# Altium schematic sheet 01 - MCU.SchDoc
size A3; SheetNumber: 1; SheetTotal: 5; Data: 20/01/2025; Revisão: RV01B; Papel: A3; Nome da Sheet: 01 - MCU
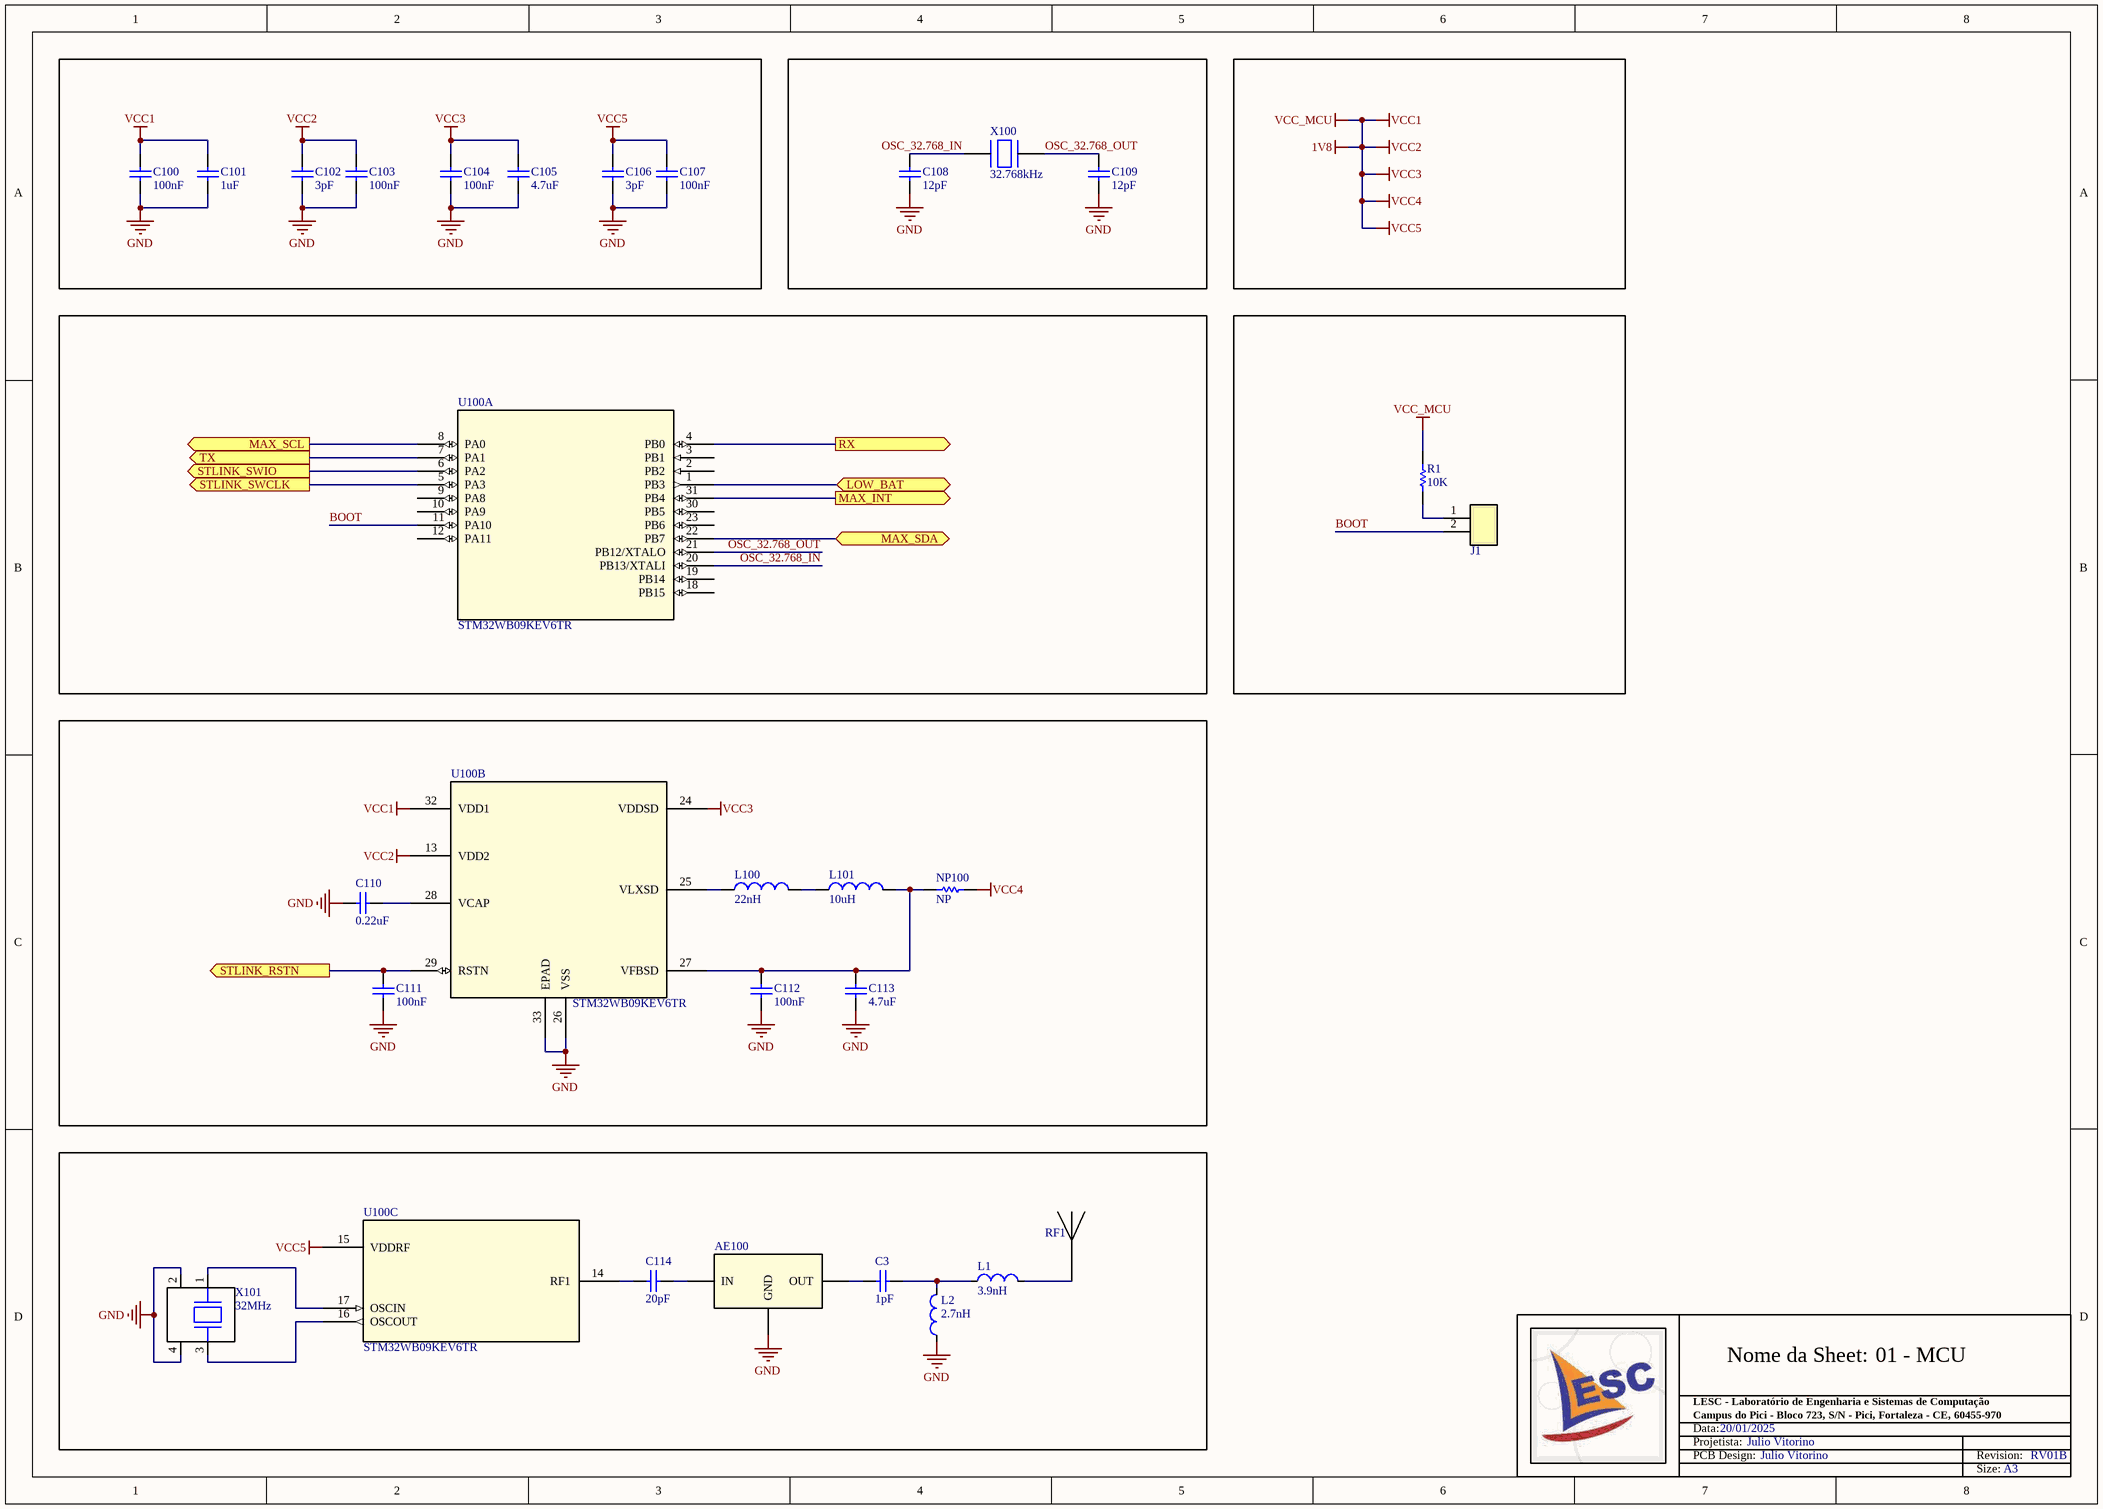
[diagram p0: 01 - MCU.SchDoc]

## Parts
AE100  RF FILTER LOW PASS 2.45GHZ 6SMD  [MLPF-WB55-01E3_STM]  (value not drawn)
C3  value 1pF  [0402-C-R-RF]  (hidden comment: GJM1555C1HR90WB01D)
C100  value 100nF  [0402-C-R]  (hidden comment: C0402C104K8RACTU)
C101  value 1uF  [0402-C-R]  (hidden comment: GRM155R61E105KA12D)
C102  value 3pF  [0402-C-R]  (hidden comment: C0402C104K8RACTU)
C103  value 100nF  [0402-C-R]  (hidden comment: C0402C104K8RACTU)
C104  value 100nF  [0402-C-R]  (hidden comment: C0402C104K8RACTU)
C105  value 4.7uF  [0402-C-R]  (hidden comment: GRM155R61A475MEAAD)
C106  value 3pF  [0402-C-R]  (hidden comment: C0402C104K8RACTU)
C107  value 100nF  [0402-C-R]  (hidden comment: C0402C104K8RACTU)
C108  value 12pF  [0402-C-R]  (hidden comment: GCM1555C1H120FA16J)
C109  value 12pF  [0402-C-R]  (hidden comment: GCM1555C1H120FA16J)
C110  value 0.22uF  [0402-C-R]  (hidden comment: C0402C104K8RACTU)
C111  value 100nF  [0402-C-R]  (hidden comment: C0402C104K8RACTU)
C112  value 100nF  [0402-C-R]  (hidden comment: C0402C104K8RACTU)
C113  value 4.7uF  [0402-C-R]  (hidden comment: GRM155R61A475MEAAD)
C114  value 20pF  [0201-C-R-RF]  (hidden comment: C0402C104K8RACTU)
J1  CONN HEADER SMD 2POS 1.27MM  [HARWIN_M50-3630242]  (value not drawn)
L1  value 3.9nH  [0402-R-L -RF]  (hidden comment: IND 3.9NH 300MA 170MOHM SM_1)
L2  value 2.7nH  [0402-R-L -RF]  (hidden comment: IND 2.7NH 300MA 170MOHM SM)
L100  IND: 22nH  [0402-R-L]  (hidden comment: IND 22NH 350MA 0.58OHM SMD)
L101  IND: 10uH  [0805-R-L]  (hidden comment: IND 10UH 300MA 680MOHM SMD)
NP100  NP  [0402-R-NP]
R1  value 10K  [0402-R-R]  (hidden comment: RMCF0402FT10K0)
RF1  RF ANT 2.4GHZ CHIP SOLDER SMD  [XCVR_2450AT18A0100001E]  (value not drawn)
U100  PN: STM32WB09KEV6TR  [VFQFPN-32_5x5x1mm_STM]  (hidden comment: IC ULTRA-LOW-POWER, ARM CORTEX-M0+)  (parts A,B,C of 3)
X100  value 32.768kHz  [XTAL_ECS-.327-12.5-34RR-TR]  (hidden comment: ECX-.327-CDX-1293)
X101  FRQ: 32MHz  [XTAL_ECS-320-8-37-CKM-TR3]  (hidden comment: ECS-320-8-37-CKM-TR3)

## Ports
LOW_BAT (bidir), MAX_INT (out), MAX_SCL (out), MAX_SDA (bidir), RX (out), STLINK_RSTN (out), STLINK_SWCLK (out), STLINK_SWIO (out), TX (out)

## Nets
1V8: C100.2 C101.2 C102.2 C103.2 C104.2 C105.2 C106.2 C107.2 NP100.2 R1.2 U100.13(VDD2) U100.15(VDDRF) U100.24(VDDSD) U100.32(VDD1)  [also labelled VCC1, VCC2, VCC3, VCC4, VCC5, VCC_MCU]
GND: AE100.2,4,5,6(GND) C100.1 C101.1 C102.1 C103.1 C104.1 C105.1 C106.1 C107.1 C108.1 C109.1 C110.1 C111.1 C112.1 C113.1 L2.1 U100.26(VSS) U100.33(EPAD) X101.2(GND) X101.4(GND)
BOOT: J1.2 U100.11(PA10)
LOW_BAT: U100.1(PB3) ; port LOW_BAT
MAX_INT: U100.31(PB4) ; port MAX_INT
MAX_SCL: U100.8(PA0) ; port MAX_SCL
MAX_SDA: U100.22(PB7) ; port MAX_SDA
OSC_32.768_IN: C108.2 U100.20(PB13/XTALI) X100.1(P$1)
OSC_32.768_OUT: C109.2 U100.21(PB12/XTALO) X100.2(P$2)
RX: U100.4(PB0) ; port RX
STLINK_RSTN: C111.2 U100.29(RSTN) ; port STLINK_RSTN
STLINK_SWCLK: U100.5(PA3) ; port STLINK_SWCLK
STLINK_SWIO: U100.6(PA2) ; port STLINK_SWIO
TX: U100.7(PA1) ; port TX
NetAE100_1: AE100.1(OUT) C3.1
NetAE100_3: AE100.3(IN) C114.2
NetC3_2: C3.2 L1.1 L2.2
NetC110_2: C110.2 U100.28(VCAP)
NetC112_2: C112.2 C113.2 L101.1 NP100.1 U100.27(VFBSD)
NetC114_1: C114.1 U100.14(RF1)
NetJ1_1: J1.1 R1.1
NetL1_2: L1.2 RF1.1
NetL100_1: L100.1 L101.2
NetL100_2: L100.2 U100.25(VLXSD)
NetU100_16: U100.16(OSCOUT) X101.3
NetU100_17: U100.17(OSCIN) X101.1

Not connected (* = marked no-connect by the designer): U100 2(PB2) 3(PB1) 9(PA8) 10(PA9) 12(PA11) 18(PB15) 19(PB14) 23(PB6) 30(PB5)

## Notes on the sheet
- Nome da Sheet:
- Data:
- Projetista:
- PCB Design:
- LESC - Laboratório de Engenharia e Sistemas de Computação
- Campus do Pici - Bloco 723, S/N - Pici, Fortaleza - CE, 60455-970
- Julio Vitorino
- Revision:
- Size:

## Library data of the parts
AE100 = RF FILTER LOW PASS 2.45GHZ 6SMD: 2.45GHz Center Frequency Low Pass RF Filter (Radio Frequency) 100MHz Bandwidth 1.1dB 6-SMD, No Lead PN: MLPF-WB55-01E3; Mfr_Name: STMicroelectronics; RefDes: RefDes; Type: Type; PN: MLPF-WB55-01E3
C3 = CAP SMD 1PF 50V C0G/NP0 0402: CAP CER 1PF 50V C0G/NP0 0402 PN: QSCF500Q1R0B1GV001T; TOLERANCE: 20%; SIZE: 0402; VOLTAGE: 50V; PN: QSCF500Q1R0B1GV001T
C100 C103 C104 C107 C111 C112 = CAP SMD 0402 100nF 10V ±20%: CAP SMD 0402 MLCC GERAL 100nF 10V ±20% 0402 X7R PN:C0402C104K8RACTU KEMET; SIZE: 0402; VOLTAGE: 10V; TOLERANCE: 20%; PN: C0402C104K8RACTU
C101 = CAP SMD 0402 1uF 25V ±10%: CAP SMD 0402 MLCC GERAL 1uF 25V ±10% 0402 X5R PN:GRM155R61E105KA12D MURATA; SIZE: 0402; VOLTAGE: 25V; TOLERANCE: 10%; PN: GRM155R61E105KA12D
C102 C106 = CAP SMD 0402 3pF 50V ±0.1pF: CAP CER 3PF 50V C0G/NP0 0402 PN: 0402N3R0B500CT; TOLERANCE: ±0.1pF; SIZE: 0402; VOLTAGE: 50V; PN: 0402N3R0B500CT
C105 C113 = CAP SMD 0402 4.7uF 10V ±20%: CAP SMD 0402 MLCC GERAL 4.7uF 10V ±20% 0402 X5R PN:GRM155R61A475MEAAD MURATA; SIZE: 0402; VOLTAGE: 10V; TOLERANCE: 20%; PN: GRM155R61A475MEAAD
C108 C109 = CAP SMD 0402 12pF 50V ±1%: CAP SMD CER 12pF 50V ±1% 0402 C0G,NP0 TAPE PN: GCM1555C1H120FA16J; POWER: 50V; TOLERANCE: 1%; PN: GCM1555C1H120FA16J
C110 = CAP SMD 0402 0.22uF 6.3V ±10%: CAP SMD 0402 MLCC GERAL 0.22u 6.3V ±10% 0402 X5R PN: CC0402KRX5R5BB224; SIZE: 0402; VOLTAGE: 6.3V; TOLERANCE: 10%; PN: CC0402KRX5R5BB224
C114 = CAP SMD 0201 20pF 25V ±2%: 20 pF ±2% 25V Ceramic Capacitor C0G, NP0 0201 PN: GJM0335C1E200GB01D; SIZE: 0201; VOLTAGE: 25V; TOLERANCE: 2%; PN: GJM0335C1E200GB01D
J1 = CONN HEADER SMD 2POS 1.27MM: Connector Header Surface Mount 2 position 0.050" (1.27mm) PN: M50-3630242; MF: {'manufacturer': u'Harwin Inc.'}; Package: None; Price: None; Value: *; PN: M50-3630242; Availability: Unavailable
L1 = IND 3.9NH 300MA 170MOHM SM_1: IND 3.9NH 300MA 170MOHM SM PN: LRC0402CS3N9GV001T; MF: Murata Electronics; PN: LRC0402CS3N9GV001T; Package: 1608 ICS; DigiKey-Purchase-URL: https://snapeda.com/shop?store=DigiKey&id=4221634; Mouser-Purchase-URL: https://snapeda.com/shop?store=Mouser&id=4221634; SnapEDA_Link: https://www.snapeda.com/parts/DFE18SAN1R0ME0L/Applied%20Avionics/view-part/4221634/?ref=snap
L2 = IND 2.7NH 300MA 170MOHM SM: IND 2.7NH 300MA 170MOHM SM PN: LRC0402CS2N7GV001T; MF: Murata Electronics; PN: LRC0402CS2N7GV001T; Package: 1608 ICS; DigiKey-Purchase-URL: https://snapeda.com/shop?store=DigiKey&id=4221634; Mouser-Purchase-URL: https://snapeda.com/shop?store=Mouser&id=4221634; SnapEDA_Link: https://www.snapeda.com/parts/DFE18SAN1R0ME0L/Applied%20Avionics/view-part/4221634/?ref=snap
L100 = IND 22NH 350MA 0.58OHM SMD: IND 22NH 350MA 0.58OHM SMD PN: LQG15HN22NJ02D; Part Number: DFE18SAN1R0ME0L; MF: Murata Electronics; PN: LQG15HN22NJ02D; Package: 1608 ICS; DigiKey-Purchase-URL: https://snapeda.com/shop?store=DigiKey&id=4221634; Value: *; Mouser-Purchase-URL: https://snapeda.com/shop?store=Mouser&id=4221634; SnapEDA_Link: https://www.snapeda.com/parts/DFE18SAN1R0ME0L/Applied%20Avionics/view-part/4221634/?ref=snap
L101 = IND 10UH 300MA 680MOHM SMD: FIXED IND 10UH 300MA 680MOHM SMDPN: MLZ2012M100HT000; Part Number: DFE18SAN1R0ME0L; MF: Murata Electronics; PN: MLZ2012M100HT000; Package: 1608 ICS; DigiKey-Purchase-URL: https://snapeda.com/shop?store=DigiKey&id=4221634; Value: *; Mouser-Purchase-URL: https://snapeda.com/shop?store=Mouser&id=4221634; SnapEDA_Link: https://www.snapeda.com/parts/DFE18SAN1R0ME0L/Applied%20Avionics/view-part/4221634/?ref=snap
NP100 = RES SMD 0402 NP: PACK: 0402; VALUE: NP
R1 = RES SMD 0402 10K 0.063W ±1%: RES SMD GERAL FILM 10K 0.063W ±1% 0402 7" TAPE PN: RMCF0402FT10K0 STACKPOLE; PACK: 0402; POWER: 0.063W; TOLERANCE: 1%; PN: RMCF0402FT10K0
RF1 = RF ANT 2.4GHZ CHIP SOLDER SMD: 2.4GHz Chip RF Antenna 2.4GHz ~ 2.5GHz 0.5dBi Solder Surface Mount PN: 2450AT18A0100001E; MF: Johanson; SnapEDA_Link: https://www.snapeda.com/parts/2450AT18A0100001E/AN/view-part/?ref=snap; Package: None; Value: *; PN: 2450AT18A0100001E; Check_prices: https://www.snapeda.com/parts/2450AT18A0100001E/AN/view-part/?ref=eda
U100 = IC ULTRA-LOW-POWER, ARM CORTEX-M0+: IC RF TxRx + MCU Bluetooth Bluetooth v5.4 32-VFQFN PN: STM32WB09KEV6TR; Mfr_Name: STMicroelectronics; RefDes: RefDes; Type: Type
X100 = CRYSTAL 32.768kHZ 12.5pF  SMD: MF: ECS Inc.; PN: ECX-.327-CDX-1293; Digi-Key_Part_Number: XC2292CT-ND; Package: SMD-2 ECS International; Digi-Key_Purchase_URL: https://www.digikey.in/product-detail/en/ecs-inc/ECX-.327-CDX-1293/XC2292CT-ND/6821660?utm_source=snapeda&utm_medium=aggregator&utm_campaign=symbol; SnapEDA_Link: https://www.snapeda.com/parts/ECX-.327-CDX-1293/ECS%20Inc./view-part/1733917/?ref=snap; Parameter 1: *
X101 = CRYSTAL 32.0000MHZ 8PF SMD: 32 MHz ±10ppm Crystal 8pF 60 Ohms 4-SMD, No Lead PN: ECS-320-8-37-CKM-TR3; MF: Abracon LLC; Price: None; SnapEDA_Link: https://www.snapeda.com/parts/ABM12-48.000MHZ-B2X-T3/Abracon+LLC/view-part/?ref=snap; Purchase-URL: https://pricing.snapeda.com/search/part/ABM12-48.000MHZ-B2X-T3/?ref=eda; Package: SMD-4 Abracon LLC; Availability: In Stock; PN: ECS-320-8-37-CKM-TR3; Check_prices: https://www.snapeda.com/parts/ABM12-48.000MHZ-B2X-T3/Abracon+LLC/view-part/?ref=eda